# Altium schematic sheet PowerReg.SchDoc
size Letter; SheetNumber: 4; SheetTotal: 5
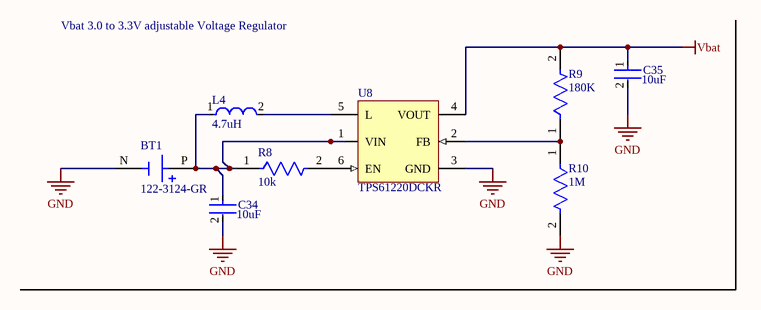
[diagram p0: PowerReg.SchDoc]

## Parts
BT1  122-3124-GR  [BAT_122-3124-GR]
C34  10uF  [FP-CGA6P-IPC_B]
C35  10uF  [FP-CGA6P-IPC_B]
L4  4.7uH  [FP-LBMF1608-0_8-0_2-MFG]
R8  10k  [FP-CPF0603-MFG]
R9  180K  [FP-CRGP0603-IPC_C]
R10  1M  [FP-CRGP0603-IPC_C]
U8  TPS61220DCKR  [DCK0006A_L]

## Nets
GND: BT1.N(NEG) C34.2 C35.2 R10.2 U8.3(GND)
Vbat: C35.1 R9.2 U8.4(VOUT)
NetBT1_P: BT1.P(POS) C34.1 L4.1 R8.1 U8.1(VIN)
NetL4_2: L4.2 U8.5(L)
NetR8_2: R8.2 U8.6(EN)
NetR9_1: R9.1 R10.1 U8.2(FB)

## Notes on the sheet
- Vbat 3.0 to 3.3V adjustable Voltage Regulator

## Library data of the parts
BT1 = CMP-00029-00003-1: Coin Cell Battery Holders CR2477 COIN CELL HL; MF: Eagle Plastic Devices; Value: *; Source: 122-3124-GR.SchLib; Check_prices: https://www.snapeda.com/parts/122-3124-GR/Eagle+Plastic+Devices/view-part/?ref=eda; MP: 122-3124-GR; Case/Package: None; Design Item ID: 122-3124-GR; SnapEDA_Link: https://www.snapeda.com/parts/122-3124-GR/Eagle+Plastic+Devices/view-part/?ref=snap; Component Type: Standard; Price: None; Availability: In Stock; Pins: 2
C34 C35 = CMP-08246-002239-1: Cap Ceramic 10uF 16V X7R 20% Pad SMD 1210 +125°C Automotive T/R; Capacitance: 10uF; Case Code (Metric): 3225; Case/Package: 1210; Termination: SMD/SMT; Tolerance: 20%; Min Operating Temperature: -55°C; Case Code (Imperial): 1210; Max Operating Temperature: 125°C; Packaging: Tape and Reel; Voltage Rating: 16V
L4 = CMP-14484-001029-1: SMD Inductors 4.7uH ±20% 0.11A 0.312Ω 0603; Max DC Current: 110mA; Shielding: Unshielded; Core Material: Ferrite; Test Frequency: 7.96MHz; DC Resistance (DCR): 240mR; Self Resonant Frequency: 45MHz; REACH SVHC: No SVHC; Tolerance: 20%; Package Quantity: 3000; Mount: Surface Mount; Case Code (Imperial): 0603; RoHS Compliant: Yes; Lead Free: Exempt; Height: 0.35mm; Max Operating Temperature: 105°C; Weight: 7.1E-05oz; Halogen Free: Halogen Free; Resistor Type: Wirewound; Width: 0.8mm; Inductance: 4.7uH; Current Rating: 110mA; Radiation Hardening: No; Packaging: Tape and Reel; Case/Package: 0603; Inductance Tolerance: 20%; Height - Seated (Max): 0.039inch; Case Code (Metric): 1608; Lead Pitch: 0.7mm; Termination: SMD/SMT; Depth: 0.9mm; Series: LB; Min Operating Temperature: -40°C; Length: 0.063inch
R8 = CMP-03211-003506-1: RES SMD 10KΩ 0.5% 1/16W 0603; Manufacturer: TE Connectivity; Manufacturer Part Number: CPF0603D10KE; Power Rating: 0.063W; Temperature Coefficient: 25ppm/°C; Voltage Rating: 50V; ComponentLink2Description: Datasheet; packaging: 5k Reel; Automotive: No; Octopart: https://octopart.com/cpf0603d10ke-te+connectivity-22737789; Composition: Thin Film; Value: 10KΩ; Category: Res; RoHS: TRUE; Height: 0.55mm; Lead Free: Yes; ComponentLink2URL: https://www.te.com/commerce/DocumentDelivery/DDEController?Action=showdoc&DocId=Data+Sheet%7F1773200%7FM%7Fpdf%7FEnglish%7FENG_DS_1773200_M.pdf%7F3-1676481-2; Temperature: -55°C to +155°C; Device Class L3: Chip SMD Resistors; Device Class L1: Passive Components; octopart_url: https://octopart.com/cpf0603d10ke-te+connectivity-22737789; Tolerance: 0.5%; Resistance: 10KΩ; Package: CPF0603; Temperature Range High: +155°C; Series: CPF; Temperature Range Low: -55°C; Device Class L2: Resistors; Ipc Land Pattern Name: RESC15580X45
R9 = CMP-03211-007120-1: CRGP0603 180KΩ 0.25W ±100ppm/°C 1% 50V; Manufacturer Part Number: CRGP0603F180K; Manufacturer: TE; Tolerance: 0.01; ComponentLink2Description: Datasheet; Lead Free: Yes; Value: 180KΩ; Height: 0.55mm; Category: Res; Temperature Range Low: -55°C; RoHS: TRUE; Temperature: -55°C to +155°C; Temperature Range High: +155°C; Temperature Coefficient: ±100ppm/°C; Resistance: 180KΩ; Power Rating: 0.25W; ComponentLink2URL: https://www.te.com/commerce/DocumentDelivery/DDEController?Action=srchrtrv&DocNm=9-1773463-9&DocType=DS&DocLang=English; Voltage Rating: 50V; Ambient Temperature Range High: +70°C; Device Class L3: Chip SMD Resistors; Device Class L2: Resistors; Composition: Thick Film; Octopart: https://octopart.com/crgp0603f180k-te+connectivity-91018731; Automotive: No; Package: CRGP0603; Device Class L1: Passive Components; Series: CRGP; Ipc Land Pattern Name: RESC16080X45
R10 = CMP-03211-004384-3: RES 1M OHM 1% 1/4W 0603; Resistance: 1MR; Max Power Dissipation: 250mW; Temperature Coefficient: 100ppm/°C; Case Code (Imperial): 0603; Min Operating Temperature: -55°C; Max Operating Temperature: 155°C; RoHS Compliant: Yes; Packaging: Cut Tape; Case/Package: 0603; Tolerance: 1%; Resistor Type: Thick Film; Case Code (Metric): 1608; Number of Terminations: 2
U8 = CMP-0347-00054-2: Boost Voltage Converter with 0.7 to 5.5 V Input and 1.8 to 5.5 V Output, -40 to 85 degC, 6-Pin SC70 (DCK), Green (RoHS & no Sb/Br); Manufacturer: Texas Instruments; SubFamily: Step-Up Regulator; Vout(Min)(V): 1.8; Vout(Max)(V): 5.5; Switching Frequency(Max)(kHz): 2000; Vin(Min)(V): 0.7; Regulated Outputs(#): 1; PackageReference: DCK0006A; PackageVersion: revG, Jan-2007; ComponentLink2Description: Package Specification; Topology: Boost; ComponentLink2URL: http://www.ti.com/litv/pdf/mpds114c; PackageDescription: 6-Pin Plastic Small-Outline Package, 2 x 1.3 mm Body, 0.65 mm Pitch, 2.1 mm Lead Span; ComponentLink1Description: Datasheet; DatasheetVersion: SLVS776; ComponentLink1URL: http://www.ti.com/general/docs/lit/getliterature.tsp?genericPartNumber=TPS61220&fileType=pdf; PartNumber: TPS61220DCKR; Code_JEDEC: MO-203-AB; Eco-Plan: Green (RoHS & no Sb/Br); Vin(Max)(V): 5.5; Mounting Technology: Surface Mount